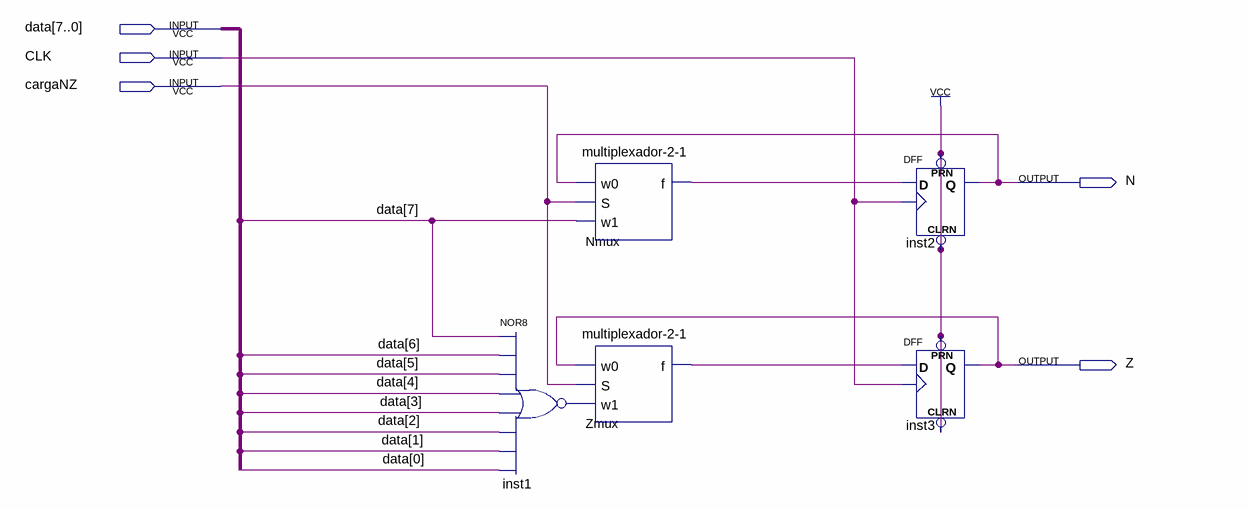
[diagram p0: schematic sheet]
// Quartus schematic NZ.bdf as structural Verilog: 5 symbols, 5 pins
module NZ (
  input  [7:0] data,
  input  CLK,
  input  cargaNZ,
  output N,
  output Z
);

  wire inst1_out, Nmux_f, Zmux_f;

  nor inst1 (inst1_out, data[7], data[6], data[5], data[4], data[3], data[2], data[1], data[0]);
  \multiplexador-2-1  Nmux (.w0(N), .S(cargaNZ), .w1(data[7]), .f(Nmux_f));
  \multiplexador-2-1  Zmux (.w0(Z), .S(cargaNZ), .w1(inst1_out), .f(Zmux_f));
  DFF inst2 (.CLRN(1'b1), .CLK(CLK), .D(Nmux_f), .PRN(1'b1), .Q(N));
  DFF inst3 (.CLRN(1'b1), .CLK(CLK), .D(Zmux_f), .PRN(1'b1), .Q(Z));
endmodule
